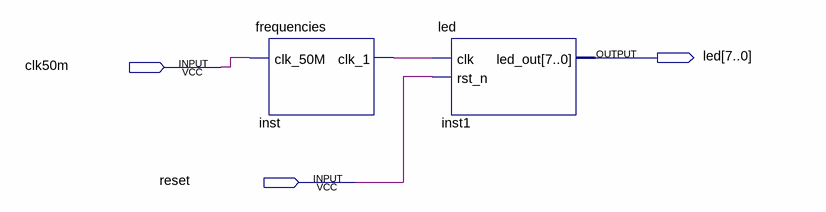
[diagram p0: schematic sheet]
// Quartus schematic test3.bdf as structural Verilog: 2 symbols, 3 pins
module test3 (
  input  clk50m,
  input  reset,
  output [7:0] led
);

  wire inst_clk_1;

  frequencies inst (.clk_50M(clk50m), .clk_1(inst_clk_1));
  led inst1 (.clk(inst_clk_1), .rst_n(reset), .led_out(led));
endmodule
